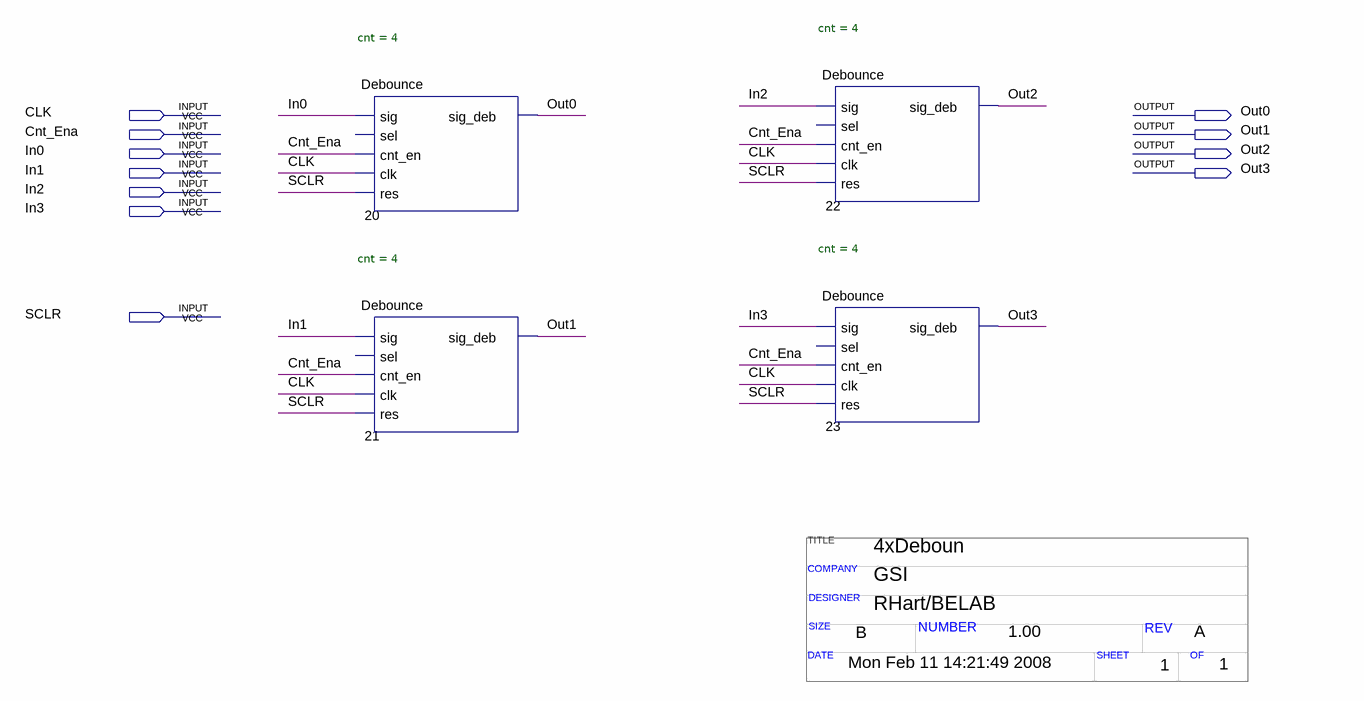
[diagram p0: schematic sheet]
// Quartus schematic 4xdeboun.bdf as structural Verilog: 4 symbols, 11 pins
// Title block: TITLE: 4xDeboun; COMPANY: GSI; DESIGNER: RHart/BELAB; SIZE: B; NUMBER: 1.00; REV: A; DATE: Mon Feb 11 14:21:49 2008; SHEET: 1; OF: 1
module \4xdeboun  (
  input  CLK,
  input  Cnt_Ena,
  input  In0,
  input  In1,
  input  In2,
  input  In3,
  input  SCLR,
  output Out0,
  output Out1,
  output Out2,
  output Out3
);

  Debounce #(.cnt(4)) u_20 (.sig(In0), .cnt_en(Cnt_Ena), .clk(CLK), .res(SCLR), .sig_deb(Out0));  // open: sel
  Debounce #(.cnt(4)) u_21 (.sig(In1), .cnt_en(Cnt_Ena), .clk(CLK), .res(SCLR), .sig_deb(Out1));  // open: sel
  Debounce #(.cnt(4)) u_22 (.sig(In2), .cnt_en(Cnt_Ena), .clk(CLK), .res(SCLR), .sig_deb(Out2));  // open: sel
  Debounce #(.cnt(4)) u_23 (.sig(In3), .cnt_en(Cnt_Ena), .clk(CLK), .res(SCLR), .sig_deb(Out3));  // open: sel
endmodule
